# EAGLE design Terminierung_RS485_RJ45_Pads_V04 (EAGLE 8.5.1)
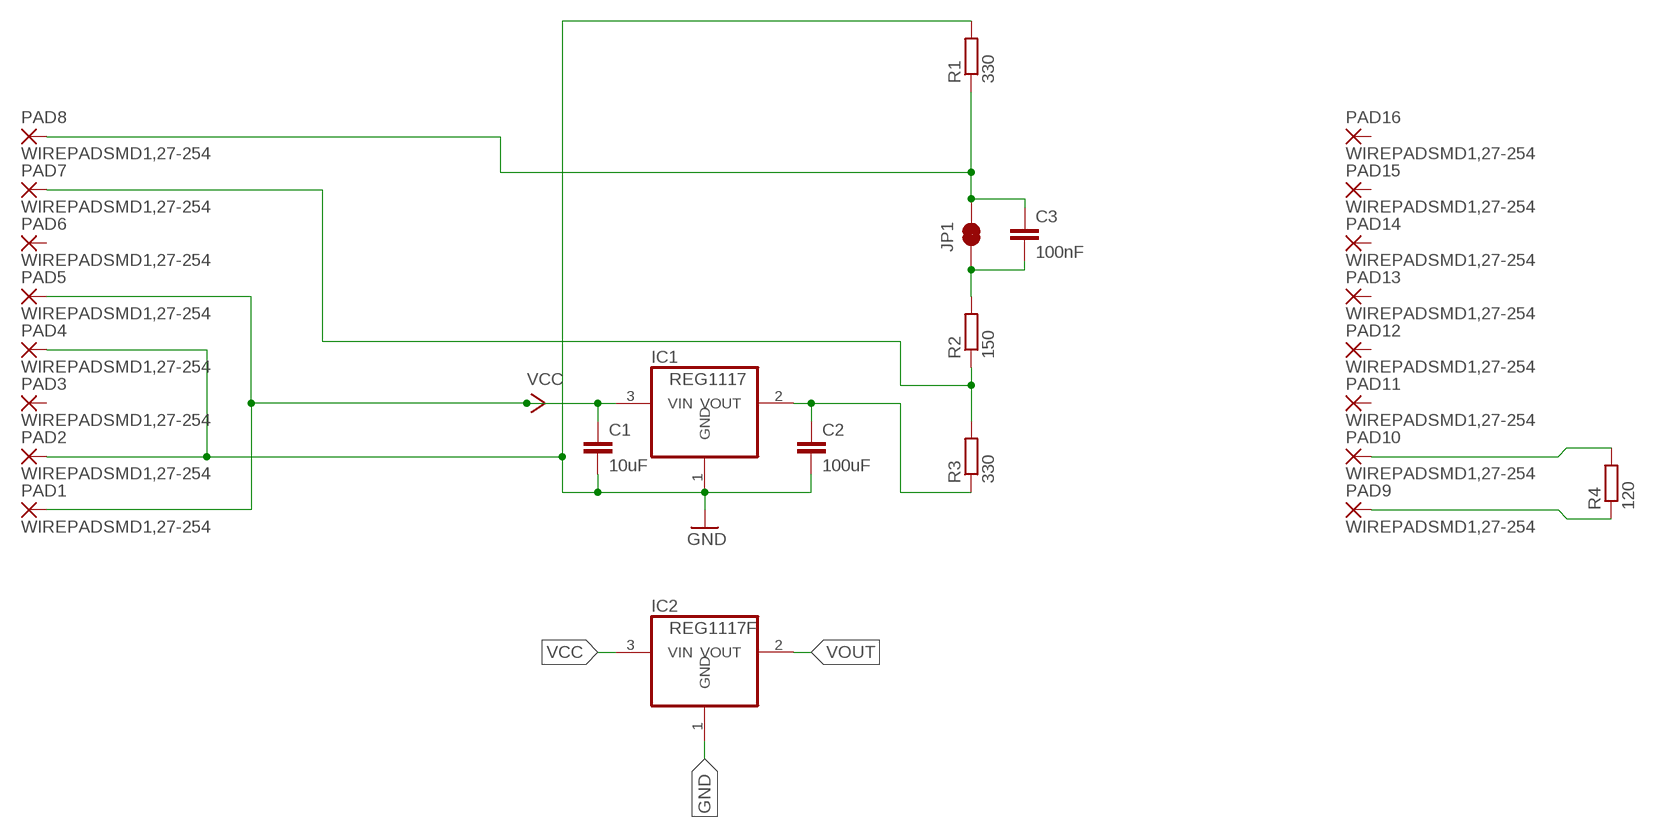
[diagram p0: schematic, sheet 1]

## Parts
C1  10uF  C-EUC0805K  [C0805K]
C2  100uF  C-EUC1210  [C1210]
C3  100nF  C-EUC0805K  [C0805K]
IC1  REG1117  [SOT223]
IC2  REG1117F  [DD-3]
JP1  JUMPER-SMT_2_NC_TRACE_SILK  [SMT-JUMPER_2_NC_TRACE_SILK]
PAD1  WIREPADSMD1,27-254  [SMD1,27-2,54]
PAD2  WIREPADSMD1,27-254  [SMD1,27-2,54]
PAD3  WIREPADSMD1,27-254  [SMD1,27-2,54]
PAD4  WIREPADSMD1,27-254  [SMD1,27-2,54]
PAD5  WIREPADSMD1,27-254  [SMD1,27-2,54]
PAD6  WIREPADSMD1,27-254  [SMD1,27-2,54]
PAD7  WIREPADSMD1,27-254  [SMD1,27-2,54]
PAD8  WIREPADSMD1,27-254  [SMD1,27-2,54]
PAD9  WIREPADSMD1,27-254  [SMD1,27-2,54]
PAD10  WIREPADSMD1,27-254  [SMD1,27-2,54]
PAD11  WIREPADSMD1,27-254  [SMD1,27-2,54]
PAD12  WIREPADSMD1,27-254  [SMD1,27-2,54]
PAD13  WIREPADSMD1,27-254  [SMD1,27-2,54]
PAD14  WIREPADSMD1,27-254  [SMD1,27-2,54]
PAD15  WIREPADSMD1,27-254  [SMD1,27-2,54]
PAD16  WIREPADSMD1,27-254  [SMD1,27-2,54]
R1  330  R-EU_R0805  [R0805]
R2  150  R-EU_R0805  [R0805]
R3  330  R-EU_R0805  [R0805]
R4  120  R-EU_R0805  [R0805]

## Nets
A: PAD7.1(P) R2.1 R3.2
B: C3.1 JP1.2 PAD8.1(P) R1.1
GND: C1.2 C2.2 IC1.1(GND) IC2.1(GND) PAD2.1(P) PAD4.1(P) R1.2
N$1: PAD10.1(P) R4.2
N$2: PAD9.1(P) R4.1
N$3: C3.2 JP1.1 R2.2
VCC: C1.1 IC1.3(VIN) IC2.3(VIN) PAD1.1(P) PAD5.1(P)
VOUT [PWR]: C2.1 IC1.2(VOUT) IC2.2(VOUT) R3.1
Unconnected: PAD3.1(P) PAD6.1(P) PAD11.1(P) PAD12.1(P) PAD13.1(P) PAD14.1(P) PAD15.1(P) PAD16.1(P)

## Library data of the parts
C1-C3 = resistor:C-EU: CAPACITOR, European symbol
IC1 = burr-brown:REG1117: 800mA and 1A Low Dropout (LDO) Positive Regulator 1.8V, 2.5V, 2.85V, 3.3V, 5V, and Adj; MPN: REG1117; OC_FARNELL: 1097566; OC_NEWARK: 14P6981
IC2 = burr-brown:REG1117: 800mA and 1A Low Dropout (LDO) Positive Regulator 1.8V, 2.5V, 2.85V, 3.3V, 5V, and Adj; MF: TEXAS INSTRUMENTS; MPN: REG1117FAKTTT; OC_FARNELL: 1296120; OC_NEWARK: 87H2562
JP1 = SparkFun-Jumpers:JUMPER-SMT_2_NC_TRACE: Normally closed trace jumper This jumper has a trace between two pads so it's normally closed (NC). Use a razor knife to open the connection. For best results follow the IPC guidelines for cutting traces: Cutout at least 0.063 mm (0.005 in). Remove all loose material to clean up the cut area. Seal the cut with an approved epoxy. Reapply solder to reclose the connection.
PAD1-PAD16 = wirepad:WIREPAD: Wire PAD connect wire on PCB
R1-R4 = resistor:R-EU_: RESISTOR, European symbol

## Net classes
0 default: width 0.254 mm
1 PWR: width 0.508 mm

## Board
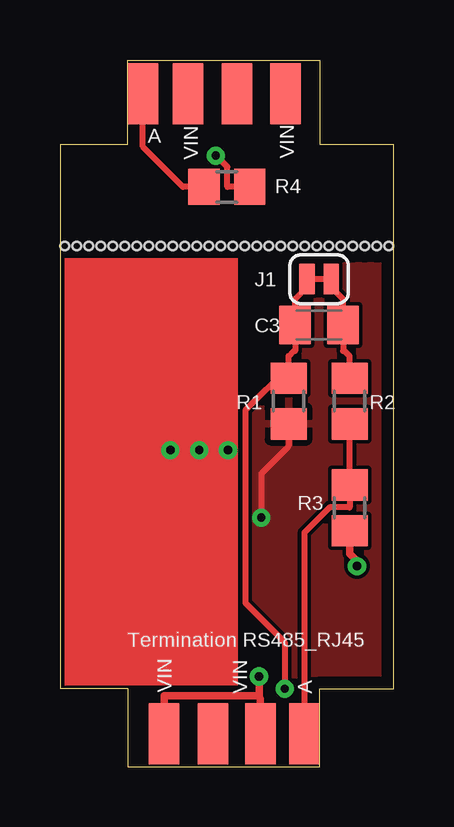
[diagram p1: board, top side]
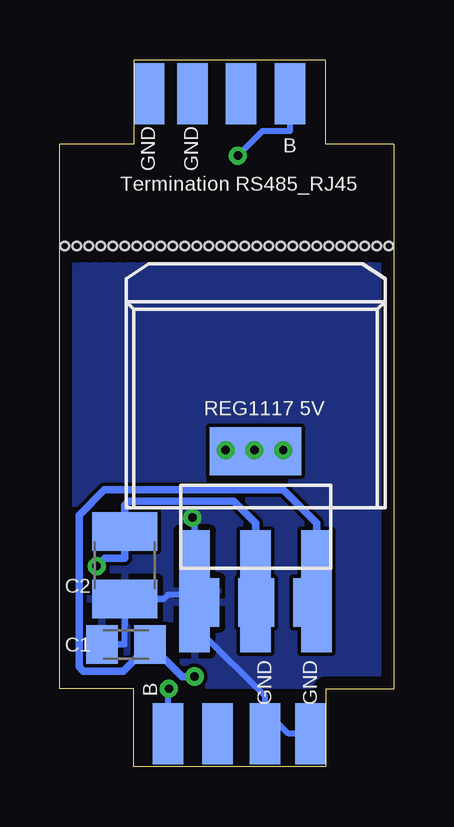
[diagram p2: board, bottom side, seen from below]

Size 13.9 x 29.45 mm. Coordinates in mm from the lower left corner, seen from the top.
Outline: 13.9,3.25 13.9,25.95 10.82,25.95 10.82,29.45 2.82,29.45 2.82,25.95 0,25.95 0,3.25 2.82,3.25 2.82,0 10.82,0 10.82,3.25 13.9,3.25
Copper layers (1*16): Top 0.035mm / dielectric 1.5mm / Bottom 0.035mm
Design rules "default *": minimum track width 6mil, minimum drill 0.35mm, track to track 6mil, track to pad 6mil, pad to pad 6mil, via to via 6mil, smd to smd 6mil, copper to edge 20mil, drill to drill 6mil, minimum pad ring 10mil, minimum via ring 8mil, stop-mask expansion 4mil, vias tented up to drill 0mil, thermal gap 10mil
Holes 0.35 mm at 0.2,21.7 0.7,21.7 1.2,21.7 1.7,21.7 2.2,21.7 2.7,21.7 3.2,21.7 3.7,21.7 4.2,21.7 4.7,21.7 5.2,21.7 5.7,21.7 6.2,21.7 6.7,21.7 7.2,21.7 7.7,21.7 8.2,21.7 8.7,21.7 9.2,21.7 9.7,21.7 10.2,21.7 10.7,21.7 11.2,21.7 11.7,21.7 12.2,21.7 12.7,21.7 13.2,21.7 13.7,21.7

### Footprints (pad centres in the part's own frame; a part is rotated, then mirrored left to right if it is on the bottom)
C0805K = smd 1.3 x 1.6: 1 -1,0; 2 1,0
C1210 = smd 1.6 x 2.7: 1 -1.4,0; 2 1.4,0
SOT223 = smd 1.499 x 2.007: 1 -2.261,-3.15; 2 0.025,-3.15; 3 2.311,-3.15 | smd 3.81 x 2.007: 4 0,3.15
DD-3 = smd 1.27 x 5.08: 1 -2.54,-7.938; 2 0,-7.938; 3 2.54,-7.938
SMT-JUMPER_2_NC_TRACE_SILK = smd 0.635 x 1.27: 1 -0.508,0; 2 0.508,0
SMD1,27-2,54 = smd 1.27 x 2.54: 1 0,0
R0805 = smd 1.3 x 1.5: 1 -0.95,0; 2 0.95,0

### Placement (x,y rotation side)
C1  11.15,5.1 180 bottom
C2  11.2,8.4 270 bottom
C3  10.79,18.41 0 top
IC1  5.75,10 0 bottom
IC2  5.75,15.25 0 bottom
JP1  10.79,20.32 180 top
PAD1  4.34,1.39 0 top
PAD2  3.47,1.39 0 bottom
PAD3  6.37,1.39 0 top
PAD4  5.35,1.39 0 bottom
PAD5  8.35,1.39 0 top
PAD6  7.33,1.39 0 bottom
PAD7  10.18,1.39 0 top
PAD8  9.4,1.39 0 bottom
PAD9  3.45,28.05 0 top
PAD10  4.32,28.05 180 bottom
PAD11  5.33,28.05 180 top
PAD12  6.35,28.05 180 bottom
PAD13  7.37,28.05 180 top
PAD14  8.38,28.05 180 bottom
PAD15  9.4,28.05 180 top
PAD16  10.19,28.05 180 bottom
R1  9.53,15.24 270 top
R2  12.06,15.24 90 top
R3  12.06,10.79 90 top
R4  6.95,24.17 0 top

### Tracks (layer width: path | path; a pad name or v marks a point on that pad's centre or on a via)
A
  Top 0.254: PAD7.1 10.18,9.76 11.24,10.82 12.06,10.82 R3.2 R2.1
B  (via drill 0.35 pad 0.76)
  Top 0.254: 9.53,16.66 7.73,14.86 7.73,6.83 9.36,5.2 v9.36,3.25 | 9.53,16.66 9.53,17.12 9.74,17.34 9.79,17.34 C3.1 9.79,19.49 10.29,19.99 JP1.2 | R1.1 9.53,16.66
  Bottom 0.254: PAD8.1 9.4,2.94 9.36,2.97 v9.36,3.25
GND  (via drill 0.35 pad 0.76)
  Top 0.254: R1.2 9.53,13.36 8.39,12.22 v8.39,10.39
  Bottom 0.254: v8.39,10.39 8.39,10.23 8.29,10.13 IC2.1 8.29,7.17 | 8.29,7.17 9.4,7.17 9.57,7 C2.2 11.2,5.92 11.22,5.9 11.22,5.1 C1.2 | 8.29,7.17 8.01,6.89 IC1.1 8.01,5.57 7.99,5.57 5.35,2.94 5.35,2.16 | PAD2.1 4.38,1.39 5.16,2.16 5.35,2.16 | PAD4.1 5.35,2.16
  pour Top: 0.2,3.4 0.2,21.4 13.8,21.4 13.8,3.4
  pour Bottom: 0.2,3.4 0.2,21.4 13.8,21.4 13.8,3.4
N$1  (via drill 0.35 pad 0.76)
  Top 0.254: R4.2 6.97,24.17 6.97,25 6.5,25.47 v6.49,25.47
  Bottom 0.254: PAD10.1 4.32,26.5 5.46,26.5 v6.49,25.47
N$2
  Top 0.254: R4.1 5.12,24.17 3.45,25.84 PAD9.1
N$3
  Top 0.254: R2.2 12.06,17.12 11.85,17.34 11.79,17.34 C3.2 11.79,19.49 11.3,19.99 JP1.1
N$4  (via drill 0.35 pad 0.76)
  other vias: 7,13.2
N$5  (via drill 0.35 pad 0.76)
  other vias: 5.8,13.2
N$6  (via drill 0.35 pad 0.76)
  other vias: 4.6,13.2
VCC  (via drill 0.35 pad 0.76)
  Top 0.305: 8.29,2.96 v8.29,3.76 | 8.29,2.96 8.29,2.9 8.35,2.85 PAD5.1 | 8.29,2.96 4.34,2.96 PAD1.1
  Bottom 0.305: v8.29,3.76 8.81,3.76 C1.1 11.26,4 12.93,4 13.11,4.17 13.11,10.48 12.05,11.54 4.59,11.54 3.21,10.16 IC2.3 3.21,7.08 IC1.3
VOUT  (via drill 0.35 pad 0.76)
  Top 0.305: R3.1 12.06,8.89 12.37,8.58 v12.37,8.36
  Bottom 0.305: IC1.2 5.72,7.29 IC2.2 5.75,10.16 6.67,11.07 11.03,11.07 11.2,10.9 C2.1 11.2,8.7 12.04,8.7 v12.37,8.36
(copper drawn outside any net)
  shapes: Top area x1

### Text on the board
tNames: A | VIN | VIN | R4 | J1 | C3 | R1 | R2 | R3 | Termination RS485_RJ45 | VIN | VIN | A
bNames: GND | GND | B | Termination RS485_RJ45 | REG1117 5V | C2 | C1 | GND | GND | B